# EAGLE design SerialCouple (EAGLE 5.11)
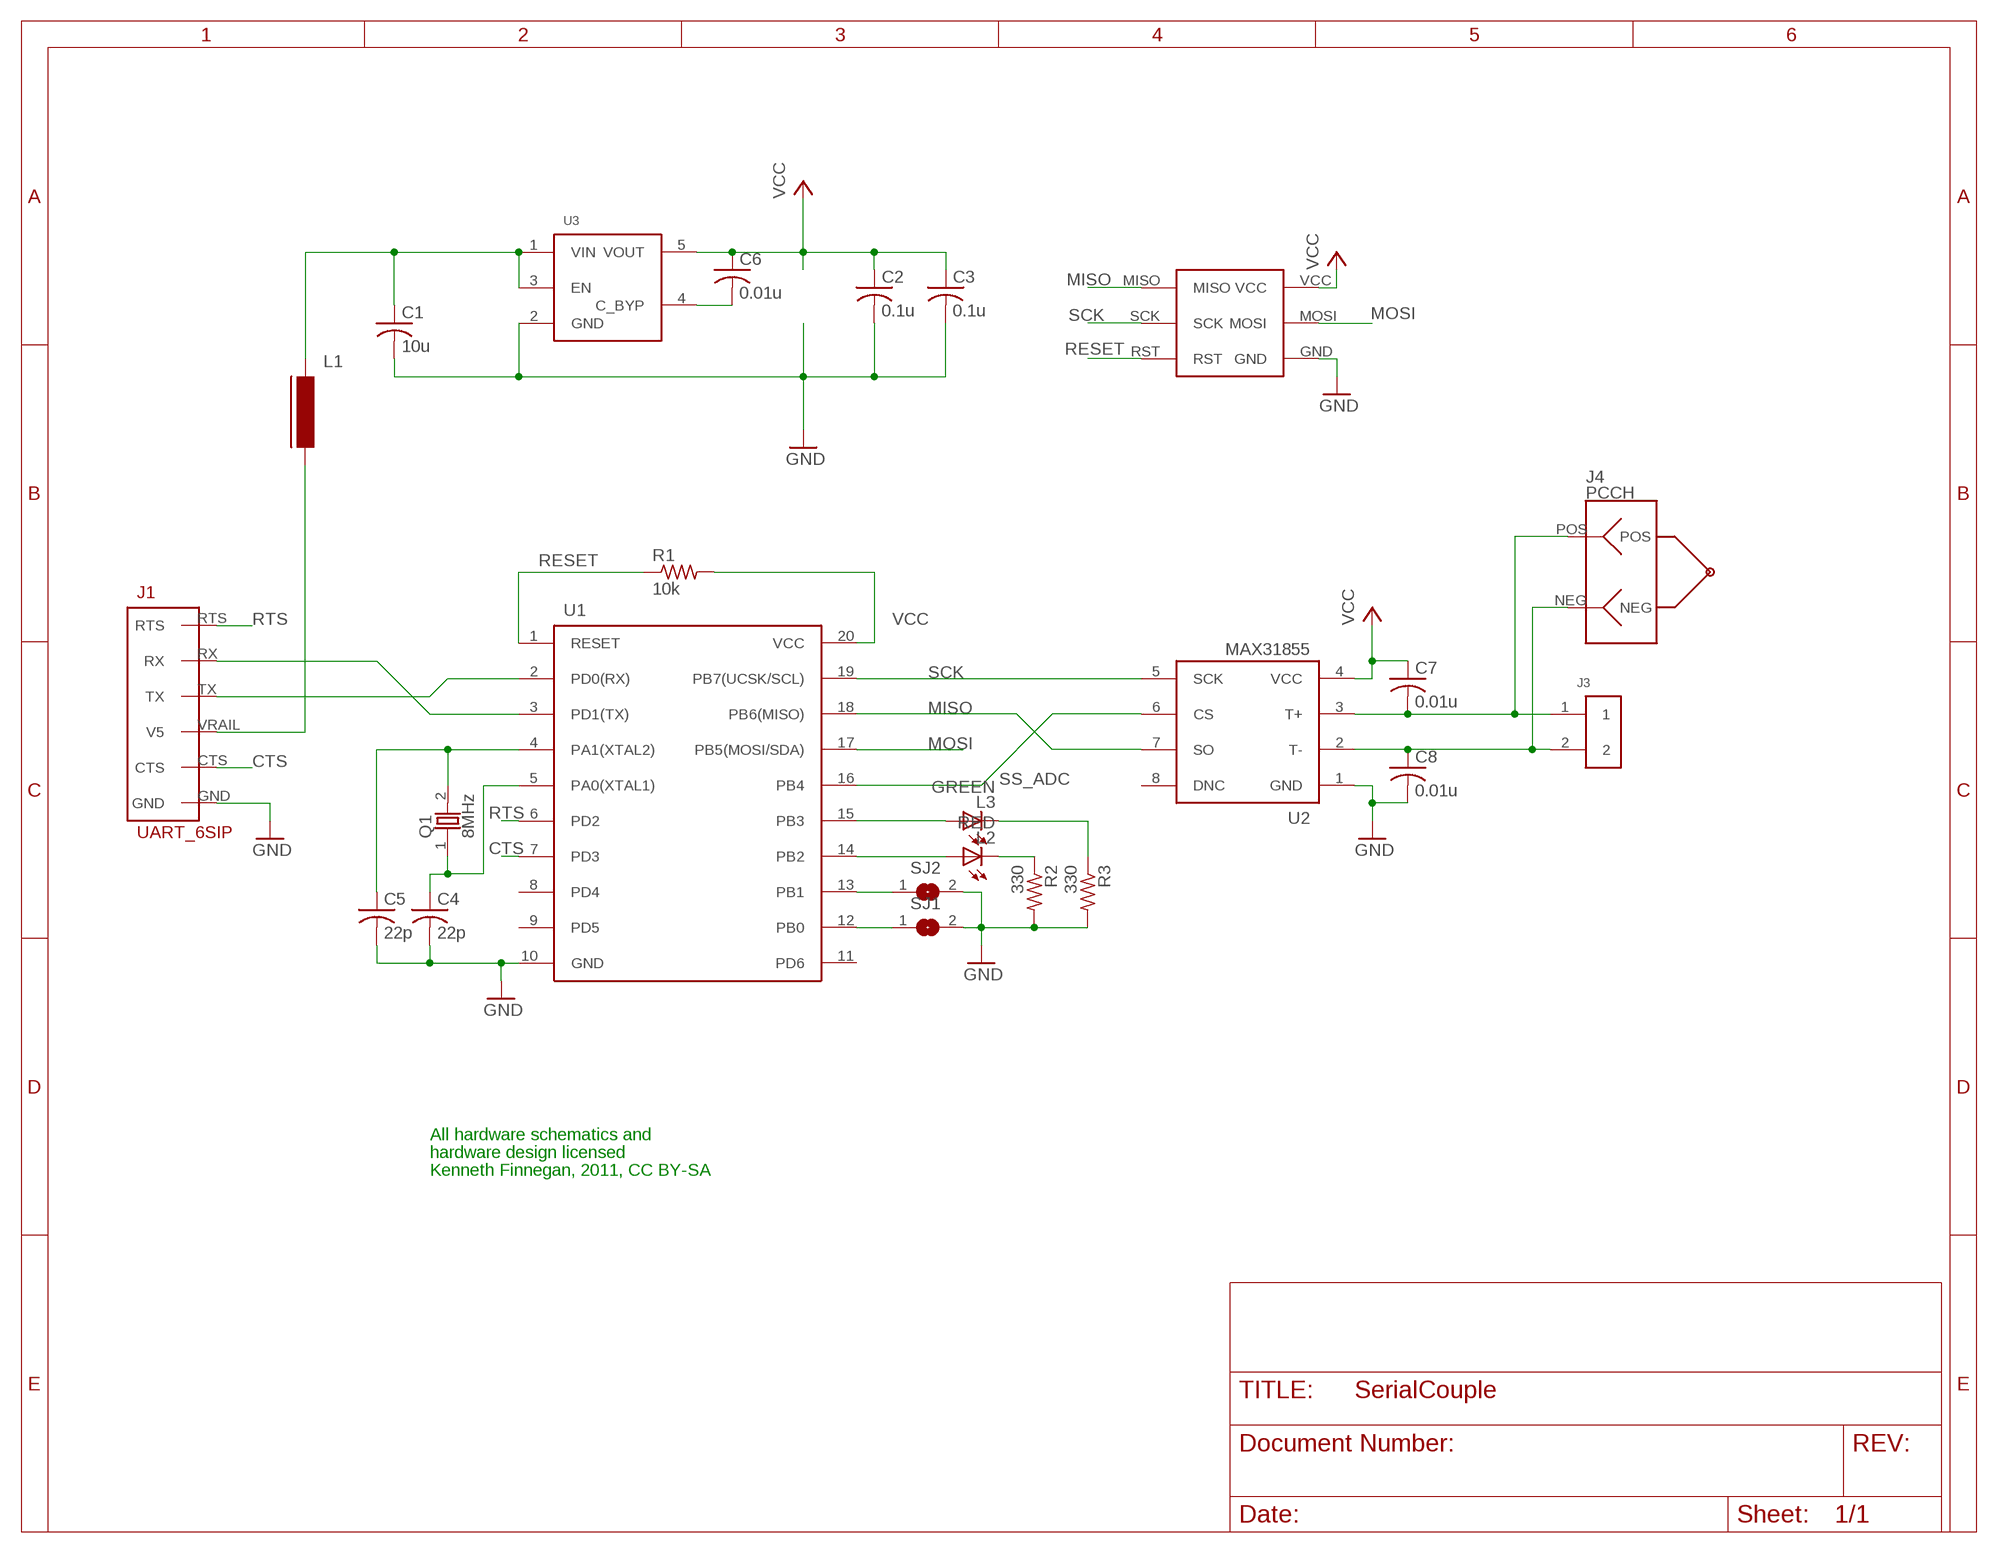
[diagram p0: schematic, sheet 1]

## Parts
C1  10u  C-USC1206  [C1206]
C2  0.1u  C-USC0603  [C0603]
C3  0.1u  C-USC0603  [C0603]
C4  22p  C-USC0603  [C0603]
C5  22p  C-USC0603  [C0603]
C6  0.01u  C-USC0603  [C0603]
C7  0.01u  C-USC0603  [C0603]
C8  0.01u  C-USC0603  [C0603]
J1  UART_6SIP  [6XR1]
J2  AVR_ICSP  [AVR_ICSP]
J3  TERM_BLOCK_2  [2XR2]
J4  PCCH  [PCC-SMP-HORZ]
L1  FERRITE_BEAD805  [FB805]
L2  RED  LEDCHIPLED_0603  [CHIPLED_0603]
L3  GREEN  LEDCHIPLED_0603  [CHIPLED_0603]
Q1  8MHz  OSC-XTAL  [HC-49U]
R1  10k  R-US_R0603  [R0603]
R2  330  R-US_R0603  [R0603]
R3  330  R-US_R0603  [R0603]
SJ1  SJ  [SJ]
SJ2  SJ  [SJ]
U1  TINY2313'2313SOIC'  [SOIC-20]
U2  MAX31855  MAX31855K  [SO08]
U3  VREG_LDOSOT  [SOT23-5L]

## Nets
CTS: J1.CTS U1.7(PD3)
GND: C1.2 C2.2 C3.2 C4.2 C5.2 C8.2 J1.GND J2.GND R2.2 R3.2 SJ1.2 SJ2.2 U1.10(GND) U2.1(GND) U3.2(GND)
J1: J1.TX U1.2(PD0(RX))
MISO: J2.MISO U1.18(PB6(MISO)) U2.7(SO)
MOSI: J2.MOSI U1.17(PB5(MOSI/SDA))
N$1: J1.RX U1.3(PD1(TX))
N$2: SJ1.1 U1.12(PB0)
N$3: C7.2 J3.1 J4.POS U2.3(T+)
N$4: C8.1 J3.2 J4.NEG U2.2(T-)
N$5: C5.1 Q1.2 U1.4(PA1(XTAL2))
N$7: SJ2.1 U1.13(PB1)
N$8: C6.2 U3.4(C_BYP)
N$9: C4.1 Q1.1 U1.5(PA0(XTAL1))
N$10: L2.A U1.14(PB2)
N$11: L3.A U1.15(PB3)
N$12: L2.C R2.1
N$13: L3.C R3.1
N$14: J1.VRAIL(V5) L1.2
RESET: J2.RST R1.1 U1.1(RESET)
RTS: J1.RTS U1.6(PD2)
SCK: J2.SCK U1.19(PB7(UCSK/SCL)) U2.5(SCK)
SS_ADC: U1.16(PB4) U2.6(CS)
VCC: C2.1 C3.1 C6.1 C7.1 J2.VCC R1.2 U1.20(VCC) U2.4(VCC) U3.5(VOUT)
VRAIL: C1.1 L1.1 U3.1(VIN) U3.3(EN)
Unconnected: U1.8(PD4) U1.9(PD5) U1.11(PD6) U2.8(DNC)

## Notes on the sheet
- All hardware schematics and
- hardware design licensed
- Kenneth Finnegan, 2011, CC BY-SA

## Library data of the parts
C1-C8 = resistor:C-US: CAPACITOR, American symbol
J1 = 0misc:UART_6
J2 = 0misc:AVR_ICSP
J3 = 0misc:TERM_BLOCK_2: Screw terminal block - Digikey WM4393-ND
J4 = 0misc:PCC: Omega PCC-series TCouple Jacks
L1 = dp_devices:FERRITE_BEAD
L2 L3 = led:LED: LED OSRAM: - CHIPLED LG R971, LG N971, LY N971, LG Q971, LY Q971, LO R971, LY R971 LH N974, LH R974 LS Q976, LO Q976, LY Q976 LO Q996 - Hyper CHIPLED LW Q18S LB Q993, LB Q99A, LB R99A - SideLED LS A670, LO A670, LY A670, LG A670, LP A670 LB A673, LV A673, LT A673, LW A673 LH A674 LY A675 LS A676, LA A676, LO A676, LY A676, LW A676 LS A679, LY A679, LG A679 - Hyper Micro SIDELED® LS Y876, LA Y876, LO Y876, LY Y876 LT Y87S - SmartLED LW L88C, LW L88S LB L89C, LB L89S, LG L890 LS L89K, LO L89K, LY L89K LS L896, LA L896, LO L896, LY L896 - TOPLED LS T670, LO T670, LY T670, LG T670, LP T670 LSG T670, LSP T670, LSY T670, LOP T670, LYG T670 LG T671, LOG T671, LSG T671 LB T673, LV T673, LT T673, LW T673 LH T674 LS T676, LA T676, LO T676, LY T676, LB T676, LH T676, LSB T676, LW T676 LB T67C, LV T67C, LT T67C, LS T67K, LO T67K, LY T67K, LW E67C LS E67B, LA E67B, LO E67B, LY E67B, LB E67C, LV E67C, LT E67C LW T67C LS T679, LY T679, LG T679 LS T770, LO T770, LY T770, LG T770, LP T770 LB T773, LV T773, LT T773, LW T773 LH T774 LS E675, LA E675, LY E675, LS T675 LS T776, LA T776, LO T776, LY T776, LB T776 LHGB T686 LT T68C, LB T68C - Hyper Mini TOPLED® LB M676 - Mini TOPLED Santana® LG M470 LS M47K, LO M47K, LY M47K Source: http://www.osram.convergy.de LUXEON: - LUMILED® LXK2-PW12-R00, LXK2-PW12-S00, LXK2-PW14-U00, LXK2-PW14-V00 LXK2-PM12-R00, LXK2-PM12-S00, LXK2-PM14-U00 LXK2-PE12-Q00, LXK2-PE12-R00, LXK2-PE12-S00, LXK2-PE14-T00, LXK2-PE14-U00 LXK2-PB12-K00, LXK2-PB12-L00, LXK2-PB12-M00, LXK2-PB14-N00, LXK2-PB14-P00, LXK2-PB14-Q00 LXK2-PR12-L00, LXK2-PR12-M00, LXK2-PR14-Q00, LXK2-PR14-R00 LXK2-PD12-Q00, LXK2-PD12-R00, LXK2-PD12-S00 LXK2-PH12-R00, LXK2-PH12-S00 LXK2-PL12-P00, LXK2-PL12-Q00, LXK2-PL12-R00 Source: www.luxeon.com KINGBRIGHT: KA-3528ASYC Source: www.kingbright.com
Q1 = dp_devices:OSC-XTAL
R1-R3 = resistor:R-US_: RESISTOR, American symbol
SJ1 SJ2 = jumper:SJ: SMD solder JUMPER
U1 = tiny2313:TINY2313
U2 = maxim2:MAX31855
U3 = 0misc:VREG_LDO

## Board
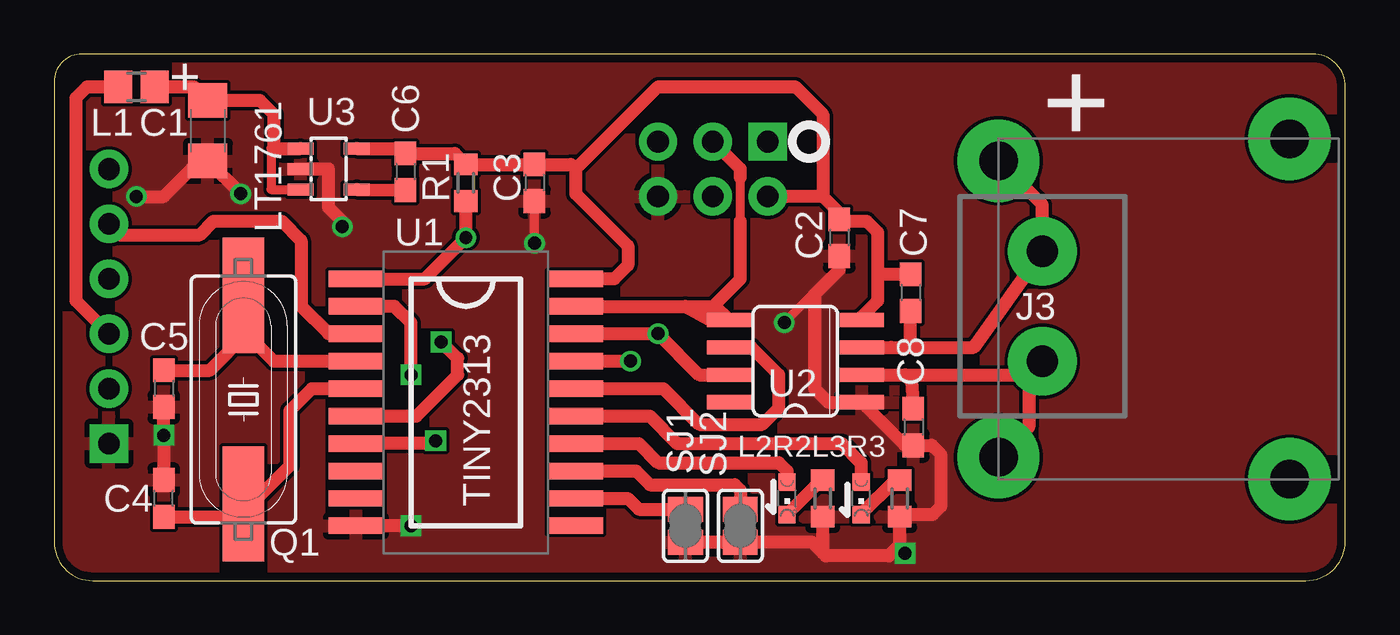
[diagram p1: board, top side]
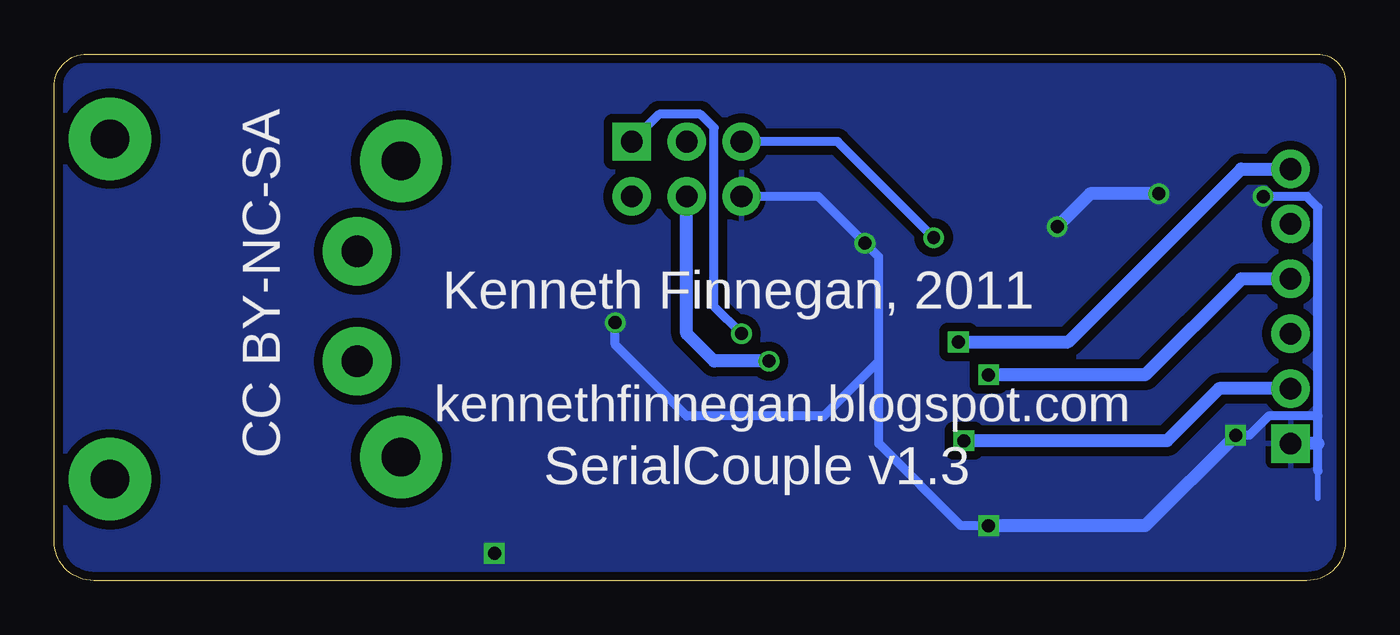
[diagram p2: board, bottom side, seen from below]

Size 59.74 x 24.37 mm. Coordinates in mm from the lower left corner, seen from the top.
Outline: 59.74,22.86 arc90 58.23,24.37 1.29,24.37 arc90 0,23.08 0,1.8 arc90 1.8,0 57.91,0 arc90 59.74,1.83 59.74,22.86
Copper layers (1*16): Top 0.0356mm / dielectric 1.5011mm / Bottom 0.0356mm
Design rules "LaenPCBOrder": minimum track width 6mil, minimum drill 13mil, track to track 6mil, track to pad 6mil, pad to pad 6mil, via to via 6mil, smd to smd 6mil, copper to edge 15mil, drill to drill 6mil, minimum pad ring 7mil, minimum via ring 7mil, stop-mask expansion 4mil, vias tented up to drill 0mil, thermal gap 10mil

### Footprints (pad centres in the part's own frame; a part is rotated, then mirrored left to right if it is on the bottom)
C1206 = smd 1.6 x 1.8: 1 -1.4,0; 2 1.4,0
C0603 = smd 1.1 x 1: 1 -0.85,0; 2 0.85,0
6XR1 = drill 1 pad 1.778 round: CTS 0,-10.16; RTS 0,0; RX 0,-2.54; TX 0,-5.08; VRAIL 0,-7.62 | drill 1 pad 1.778 square: GND 0,-12.7
AVR_ICSP = drill 1 pad 1.778 round: GND 1.27,-2.54; MOSI 1.27,0; RST -1.27,-2.54; SCK -1.27,0; VCC 1.27,2.54 | drill 1 pad 1.778 square: MISO -1.27,2.54
2XR2 = drill 1.448 pad 3.175 round: 1 0,-2.54; 2 0,2.54
PCC-SMP-HORZ = drill 1.778 pad 3.81 round: GND@1 -7.874,5.588; GND@2 7.874,5.588; NEG 6.858,-7.874; POS -6.858,-7.874
FB805 = smd 1.3 x 1.5: 1 -0.85,0; 2 0.85,0
CHIPLED_0603 = smd 0.8 x 0.8: A 0,-0.75; C 0,0.75
HC-49U = smd 5.334 x 1.93: 1 -4.826,0; 2 4.826,0
R0603 = smd 1 x 1.1: 1 -0.85,0; 2 0.85,0
SJ = smd 1.168 x 1.6: 1 -0.762,0; 2 0.762,0
SOIC-20 = smd 2.54 x 0.762: 1 -7.62,5.08; 2 -7.62,3.81; 3 -7.62,2.54; 4 -7.62,1.27; 5 -7.62,0; 6 -7.62,-1.27; 7 -7.62,-2.54; 8 -7.62,-3.81; 9 -7.62,-5.08; 10 -7.62,-6.35; 11 2.54,-6.35; 12 2.54,-5.08; 13 2.54,-3.81; 14 2.54,-2.54; 15 2.54,-1.27; 16 2.54,0; 17 2.54,1.27; 18 2.54,2.54; 19 2.54,3.81; 20 2.54,5.08
SO08 = smd 0.66 x 2.032: 1 -1.905,-3.073; 2 -0.635,-3.073; 3 0.635,-3.073; 4 1.905,-3.073; 5 1.905,3.073; 6 0.635,3.073; 7 -0.635,3.073; 8 -1.905,3.073
SOT23-5L = smd 0.55 x 1.2: 1 -0.95,-1.3; 2 0,-1.3; 3 0.95,-1.3; 4 0.95,1.3; 5 -0.95,1.3

### Placement (x,y rotation side)
C1  7.11,20.83 270 top
C2  36.32,15.88 270 top
C3  22.23,18.41 270 top
C4  5.08,3.81 90 top
C5  5.08,8.89 270 top
C6  16.26,18.92 270 top
C7  39.62,13.34 270 top
C8  39.75,7.11 270 top
J1  2.54,19.05 0 top
J2  30.48,19.05 270 top
J3  45.72,12.7 180 top
J4  51.56,12.57 270 top
L1  3.81,22.86 180 top
L2  33.91,3.81 180 top
L3  37.34,3.81 180 top
Q1  8.76,8.38 90 top
R1  19.05,18.41 90 top
R2  35.56,3.81 270 top
R3  39.12,3.81 270 top
SJ1  29.21,2.54 270 top
SJ2  31.75,2.54 270 top
U1  21.59,8.89 0 top
U2  34.29,10.16 90 top
U3  12.7,19.05 270 top

### Tracks (layer width: path | path; a pad name or v marks a point on that pad's centre or on a via)
CTS  (via drill 0.6)
  Top 0.61: U1.7 17.53,6.35 v17.65,6.48
  Bottom 0.61: v17.65,6.48 8.26,6.48 5.84,8.89 J1.CTS
GND  (via drill 0.6)
  Top 0.406: v22.23,15.62 C3.2 | 35.18,13.25 35.09,13.25 v33.78,11.94
  Top 0.61: C5.2 v5.08,6.73 C4.2 | SJ1.2 SJ2.2 35.05,1.78 35.56,1.27 | v16.51,2.54 U1.10 | v3.81,17.78 5.08,17.78 6.35,19.05 6.73,19.05 C1.2 v8.64,17.91 | R3.2 39.2,3.05 40.64,3.05 41.02,3.43 41.02,5.84 40.6,6.26 C8.2 39.36,6.26 U2.1 35.81,8.26 35.18,8.89 35.18,13.25 36.32,14.39 C2.2 | R3.2 39.12,1.52 v39.37,1.27 | R3.2 39.12,1.65 38.61,1.14 35.69,1.14 35.56,1.27 | 35.56,1.27 R2.2 | v13.34,16.38 13.34,16.64 12.7,17.27 12.7,19.05 U3.2
  Bottom 0.254: 1.27,3.81 1.27,5.08
  Bottom 0.406: v3.81,17.78 1.78,17.78 1.27,17.27 1.27,7.62 | 1.27,5.08 1.27,6.35 1.27,7.62 | v5.08,6.73 4.45,6.73 3.56,7.62 1.27,7.62 | J2.GND 24.38,17.78 v22.23,15.62 21.59,14.99 21.59,10.16 | v33.78,11.94 33.78,10.92 30.48,7.62 24.13,7.62 21.59,10.16 | v16.51,2.54 17.78,2.54 21.59,6.35 21.59,10.16
  Bottom 0.61: 1.27,6.35 J1.GND | v16.51,2.54 9.27,2.54 v5.08,6.73 | v8.64,17.91 11.81,17.91 v13.34,16.38
  pour Bottom (isolate 0.406): 0,25.4 59.69,25.4 59.69,0 0,0
  pour Top: 0,25.4 59.69,25.4 59.69,0 0,0
J1  (via drill 0.6)
  Top 0.61: U1.2 15.75,12.7 16.51,11.94 v16.51,9.53
  Bottom 0.61: v16.51,9.53 9.27,9.53 4.83,13.97 J1.TX
MISO  (via drill 0.6)
  Top 0.61: U1.18 v27.94,11.43 29.84,9.53 U2.7
  Bottom 0.406: J2.MISO 31.75,21.59 29.84,21.59 29.21,20.95 29.21,12.7 v27.94,11.43
MOSI  (via drill 0.6)
  Top 0.61: U1.17 v26.67,10.16
  Bottom 0.61: J2.MOSI 30.48,11.43 29.21,10.16 v26.67,10.16
N$1
  Top 0.61: U1.3 12.7,11.43 11.43,12.7 11.43,15.75 10.54,16.64 7.37,16.64 6.73,16 3.05,16 J1.RX
N$2
  Top 0.61: SJ1.1 27.05,3.3 26.54,3.81 U1.12
N$3
  Top 0.61: 39.37,10.79 U2.3 38.73,10.79 | 39.37,10.79 42.55,10.79 J3.1 45.72,17.4 J4.POS | C7.2 39.62,11.05 39.37,10.79
N$4
  Top 0.61: U2.2 39.37,9.53 | 39.37,9.53 45.09,9.53 | 45.09,9.53 J3.2 | C8.1 39.66,9.23 39.37,9.53 | 45.09,9.53 45.09,7.11 J4.NEG
N$5
  Top 0.61: U1.4 10.16,10.16 8.89,11.43 | 8.89,11.43 8.89,13.08 Q1.2 | C5.1 7.2,9.74 8.89,11.43
N$7
  Top 0.61: SJ2.1 31.75,4.19 31.5,4.45 27.56,4.45 26.92,5.08 U1.13
N$8
  Top 0.61: U3.4 C6.2
N$9
  Top 0.61: C4.1 8.17,2.96 Q1.1 9.14,3.56 10.92,5.33 10.92,7.87 11.94,8.89 U1.5
N$10
  Top 0.61: U1.14 27.05,6.35 27.94,5.46 33.53,5.46 33.91,5.08 L2.A
N$11
  Top 0.61: U1.15 27.56,7.62 28.83,6.35 36.45,6.35 37.34,5.46 L3.A
N$12
  Top 0.61: L2.C 35.51,4.66 R2.1
N$13
  Top 0.61: L3.C 38.94,4.66 R3.1
N$14
  Top 0.61: J1.VRAIL 1.02,12.95 1.02,22.35 1.52,22.86 L1.2
RESET  (via drill 0.6)
  Top 0.61: R1.1 v19.05,15.88 17.14,13.97 U1.1
  Bottom 0.406: J2.RST 23.5,20.32 v19.05,15.88
RTS  (via drill 0.6)
  Top 0.61: U1.6 16.76,7.62 18.67,9.53 18.67,10.29 v17.91,11.05
  Bottom 0.61: v17.91,11.05 12.83,11.05 4.83,19.05 J1.RTS
SCK
  Top 0.305: 30.48,12.7 30.58,12.7
  Top 0.406: 31.75,16.64 31.75,18.67
  Top 0.61: U1.19 29.21,12.7 | 29.21,12.7 30.48,12.7 31.75,13.97 31.75,16.64 | 30.58,12.7 U2.5 | J2.SCK 31.75,19.05 31.75,18.67 | 29.21,12.7 30.35,12.06
SS_ADC
  Top 0.305: 32.26,10.79 U2.6
  Top 0.61: U1.16 28.19,8.89 29.84,7.24 32.77,7.24 33.53,8 33.53,9.53 32.26,10.79
VCC
  Top 0.61: 24.13,19.05 23.91,19.27 C3.1 R1.2 18.54,19.77 C6.1 16.03,20 U3.5 | 35.56,17.78 J2.VCC | 35.56,17.78 35.56,21.59 34.29,22.86 27.94,22.86 24.13,19.05 | U1.20 25.91,13.97 26.54,14.61 26.54,15.49 24.13,17.91 24.13,19.05 | 35.56,17.78 36.45,16.89 C2.1 36.41,16.64 37.59,16.64 38.1,16.13 38.1,13.97 | U2.4 37.36,12.22 38.1,12.95 38.1,13.97 | C7.1 38.31,14.19 38.1,13.97
VRAIL
  Top 0.305: 10.16,20 10.03,20
  Top 0.406: U3.3 10.03,18.1 10.03,20
  Top 0.61: U3.1 10.16,20 10.16,21.59 9.52,22.23 C1.1 6.48,22.86 L1.1

### Text on the board
tPlace: + | L2R2L3R3
tNames: + | LT1761 | TINY2313
bNames: CC BY-NC-SA | Kenneth Finnegan, 2011 | kennethfinnegan.blogspot.com | SerialCouple v1.3